# Altium project sg3525_highVol.PrjPCB
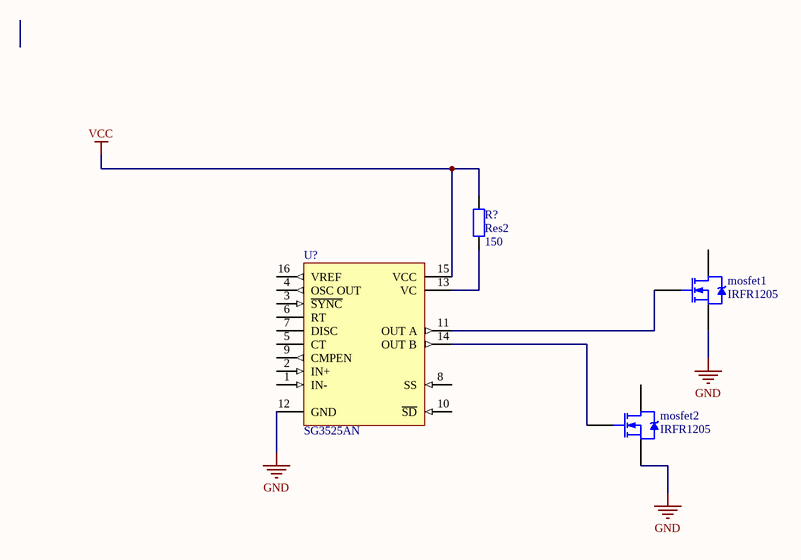
[diagram p0: sg3525_highvol.SchDoc]
1 sheet, 4 parts. Net scope: global (net labels, ports and power ports of the same name join across sheets).
Board file: sg3525_highVol_pcb.PcbDoc

## Sheet sg3525_highvol.SchDoc
size A

### Parts
mosfet1  IRFR1205  [TO-252AA_N]
mosfet2  IRFR1205  [TO-252AA_N]
R?  Res2  value 150  [AXIAL-0.4]
U?  SG3525AN  [648-08]

### Nets
GND: mosfet1.3(S) mosfet2.3(S) U?.12(GND)
VCC: R?.2 U?.15(VCC)
Netmosfet1_1: mosfet1.1(G) U?.11(OUT_A)
Netmosfet2_1: mosfet2.1(G) U?.14(OUT_B)
NetR?_1: R?.1 U?.13(VC)

Not connected (* = marked no-connect by the designer): mosfet1 4(D); mosfet2 4(D); U? 1(IN-) 2(IN+) 3(~{SYNC}) 4(OSC_OUT) 5(CT) 6(RT) 7(DISC) 8(SS) 9(CMPEN) 10(~{SD}) 16(VREF)

### Library data of the parts
mosfet1 mosfet2 = IRFR1205: HEXFET Power MOSFET; Note: Pin 2 is trimmed and is electrically connected to Drain.; Published: 8-Jun-2000; LatestRevisionDate: 20-Nov-2009; LatestRevisionNote: IPC-7351 Footprint Added.; DatasheetVersion: PD-91318B; PackageVersion: Feb-2003; PackageReference: TO-252AA; Publisher: Altium Limited; PackageDescription: 3-Pin HEXFET Package 2.28 mm Pitch, 9.9 mm Lead Span; Code_JEDEC: TO-252-AA; ComponentLink1Description: Manufacturer Link; ComponentLink1URL: http://www.irf.com/; ComponentLink2Description: Datasheet; ComponentLink2URL: http://www.irf.com/product-info/datasheets/data/irfr1205.pdf
R? = Res2: Resistor; Published: 8-Jun-2000; LatestRevisionDate: 17-Jul-2002; LatestRevisionNote: Re-released for DXP Platform.; PackageReference: AXIAL-0.4; Publisher: Altium Limited; PackageDescription: Axial Device, Thru-Hole; 2 Leads; 0.4 in Pin Spacing
U? = SG3525AN: Pulse Width Modulator Control Circuit; Published: 15-Apr-2002; DatasheetVersion: 1996; PackageVersion: Apr-2000; PackageReference: 648-08; Publisher: Altium Limited; PackageDescription: DIP; 16 Leads; Row Spacing 7.62 mm; Pitch 2.54 mm; Code_JEDEC: MS-001-BB; ComponentLink1Description: Manufacturer Link; ComponentLink1URL: http://www.onsemi.com/site/products/taxonomy/0,4438,503,00.html; ComponentLink2Description: Datasheet; ComponentLink2URL: http://www.onsemi.com/pub/Collateral/SG3525A-D.PDF